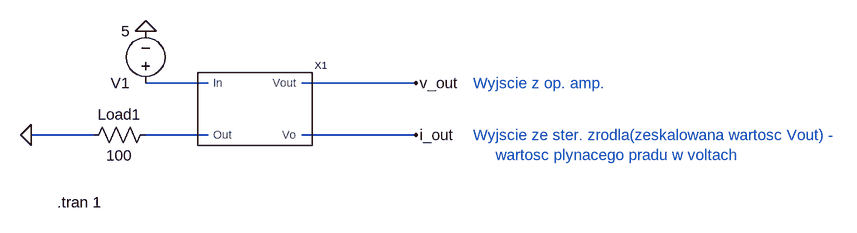
[diagram p0: schematic current_meas_example_sym.asc]
current_meas_example_sym.asc, the LTspice schematic file:
Version 4
SHEET 1 1332 680
WIRE -80 96 -176 96
WIRE 240 96 64 96
WIRE -256 176 -352 176
WIRE -80 176 -176 176
WIRE 240 176 64 176
FLAG -352 176 0
FLAG -176 16 0
FLAG 240 96 v_out
FLAG 240 176 i_out
SYMBOL CuMeas 0 224 R0
SYMATTR InstName X1
SYMBOL voltage -176 112 R180
WINDOW 123 0 0 Left 2
WINDOW 39 0 0 Left 2
SYMATTR InstName V1
SYMATTR Value 5
SYMBOL res -160 160 R90
WINDOW 0 0 56 VBottom 2
WINDOW 3 32 56 VTop 2
SYMATTR InstName Load1
SYMATTR Value 100
TEXT -312 280 Left 2 !.tran 1
TEXT 328 96 Left 2 ;Wyjscie z op. amp.
TEXT 328 176 Left 2 ;Wyjscie ze ster. zrodla(zeskalowana wartosc Vout) -\n     wartosc plynacego pradu w voltach

The netlist it stands for:
* current_meas_example_sym.asc
XX1 N001 N002 v_out i_out CuMeas  ; pins In Out Vout Vo
V1 N001 0 5
R§Load1 N002 0 100
.tran 1
* Wyjscie z op. amp.
* Wyjscie ze ster. zrodla(zeskalowana wartosc Vout) -
*      wartosc plynacego pradu w voltach
.backanno
.end